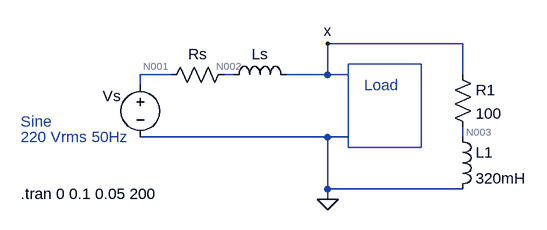
[diagram p0: schematic Fig1.asc]
Fig1.asc, the LTspice schematic file:
Version 4
SHEET 1 880 680
WIRE 528 16 320 16
WIRE 80 64 32 64
WIRE 176 64 160 64
WIRE 320 64 320 16
WIRE 320 64 256 64
WIRE 352 64 320 64
WIRE 528 64 528 16
WIRE 32 80 32 64
WIRE 320 160 32 160
WIRE 352 160 320 160
WIRE 528 160 528 144
WIRE 320 240 320 160
WIRE 528 240 320 240
WIRE 320 256 320 240
FLAG 320 16 x
FLAG 320 256 0
SYMBOL voltage 32 64 R0
WINDOW 0 -58 33 Left 2
WINDOW 3 -183 95 Invisible 2
WINDOW 123 0 0 Left 2
WINDOW 39 0 0 Left 2
SYMATTR InstName Vs
SYMATTR Value SINE(0 311 50)
SYMBOL res 176 48 R90
WINDOW 0 0 56 VBottom 2
WINDOW 3 32 56 Invisible 2
SYMATTR InstName Rs
SYMATTR Value 1
SYMBOL ind 160 80 R270
WINDOW 0 32 56 VTop 2
WINDOW 3 5 56 Invisible 2
SYMATTR InstName Ls
SYMATTR Value 1000nH
SYMBOL res 512 48 R0
SYMATTR InstName R1
SYMATTR Value 100
SYMBOL ind 512 144 R0
SYMATTR InstName L1
SYMATTR Value 320mH
TEXT -152 160 Left 2 ;220 Vrms 50Hz
TEXT -152 136 Left 2 ;Sine
TEXT 376 80 Left 2 ;Load
TEXT -152 248 Left 2 !.tran 0 0.1 0.05 200
RECTANGLE Normal 464 176 352 48

The netlist it stands for:
* Fig1.asc
Vs N001 0 SINE(0 311 50)
Rs N002 N001 1
Ls N002 x 1000nH
R1 x N003 100
L1 N003 0 320mH
* 220 Vrms 50Hz
* Sine
* Load
.tran 0 0.1 0.05 200
.backanno
.end

* Results of the author's LTspice run, read from the files saved beside the schematic
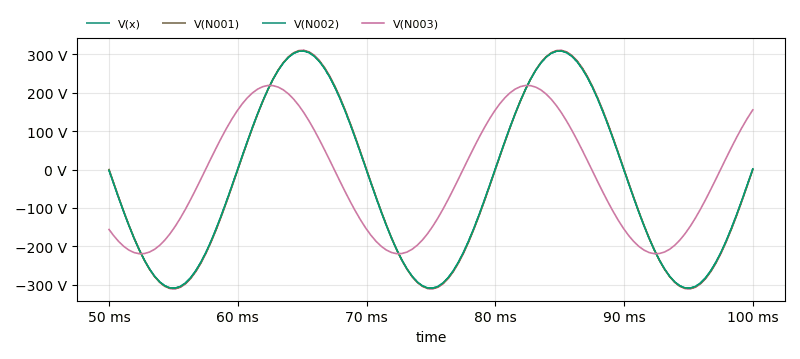
[diagram p1: Transient Analysis of Fig1.asc, plotted from the saved traces]
* Transient Analysis, 1 run:
*   V(x): min -308.8 V, max 308.8 V, average -39.31 V, rms 218.6 V, last 1.541 V
*   V(N001): min -310.4 V, max 310.4 V, average -39.51 V, rms 219.7 V, last 0 V
*   V(N002): min -308.8 V, max 308.8 V, average -39.31 V, rms 218.6 V, last 1.54 V
*   V(N003): min -219.1 V, max 219 V, average -19.68 V, rms 155 V, last 155.5 V